# EAGLE design 8 bit (EAGLE 9.6.2)
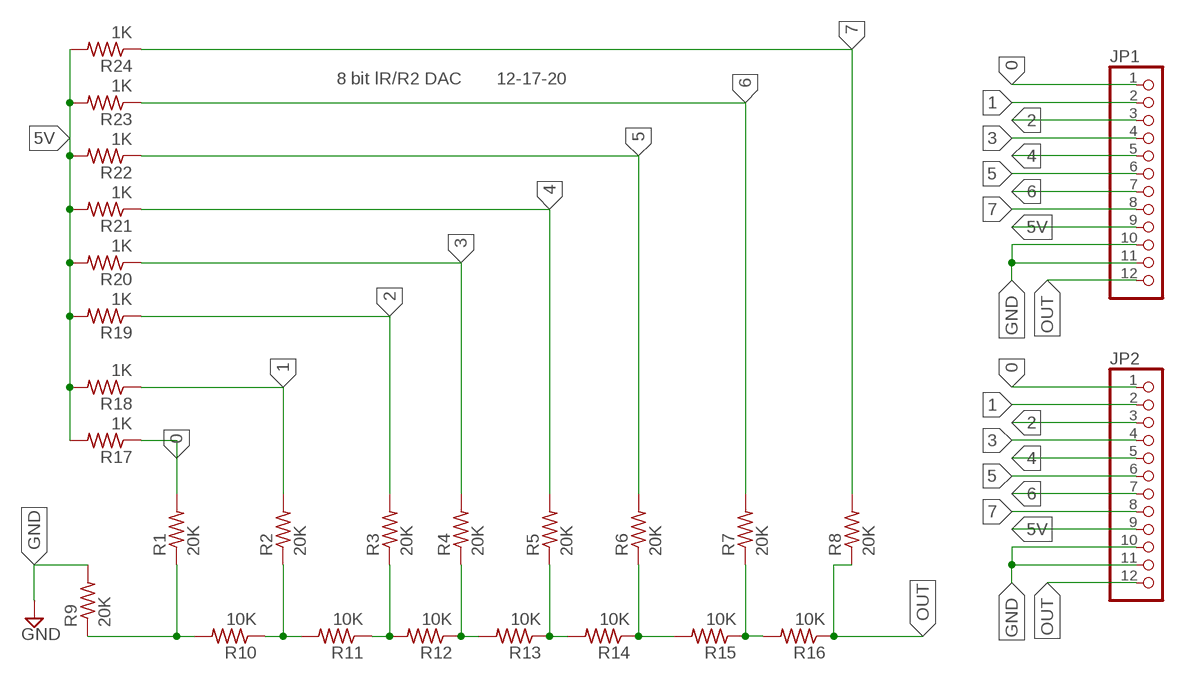
[diagram p0: schematic, sheet 1]

## Parts
JP1  PINHD-1X12  [1X12]
JP2  PINHD-1X12  [1X12]
R1  20K  R-US_0204/7  [0204/7]
R2  20K  R-US_0204/7  [0204/7]
R3  20K  R-US_0204/7  [0204/7]
R4  20K  R-US_0204/7  [0204/7]
R5  20K  R-US_0204/7  [0204/7]
R6  20K  R-US_0204/7  [0204/7]
R7  20K  R-US_0204/7  [0204/7]
R8  20K  R-US_0204/7  [0204/7]
R9  20K  R-US_0204/7  [0204/7]
R10  10K  R-US_0204/7  [0204/7]
R11  10K  R-US_0204/7  [0204/7]
R12  10K  R-US_0204/7  [0204/7]
R13  10K  R-US_0204/7  [0204/7]
R14  10K  R-US_0204/7  [0204/7]
R15  10K  R-US_0204/7  [0204/7]
R16  10K  R-US_0204/7  [0204/7]
R17  1K  R-US_0204/7  [0204/7]
R18  1K  R-US_0204/7  [0204/7]
R19  1K  R-US_0204/7  [0204/7]
R20  1K  R-US_0204/7  [0204/7]
R21  1K  R-US_0204/7  [0204/7]
R22  1K  R-US_0204/7  [0204/7]
R23  1K  R-US_0204/7  [0204/7]
R24  1K  R-US_0204/7  [0204/7]

## Nets
0: JP1.1 JP2.1 R1.2 R17.1
1: JP1.2 JP2.2 R2.2 R18.1
2: JP1.3 JP2.3 R3.2 R19.1
3: JP1.4 JP2.4 R4.2 R20.1
4: JP1.5 JP2.5 R5.2 R21.1
5: JP1.6 JP2.6 R6.2 R22.1
5V: JP1.9 JP2.9 R17.2 R18.2 R19.2 R20.2 R21.2 R22.2 R23.2 R24.2
6: JP1.7 JP2.7 R7.2 R23.1
7: JP1.8 JP2.8 R8.2 R24.1
GND: JP1.10 JP1.11 JP2.10 JP2.11 R9.2
N$1: R1.1 R9.1 R10.2
N$2: R2.1 R10.1 R11.2
N$3: R3.1 R11.1 R12.2
N$4: R4.1 R12.1 R13.2
N$5: R5.1 R13.1 R14.2
N$6: R6.1 R14.1 R15.2
N$7: R7.1 R15.1 R16.2
OUT: JP1.12 JP2.12 R8.1 R16.1

## Notes on the sheet
- 8 bit lR/R2 DAC | 12-17-20

## Library data of the parts
JP1 JP2 = adafruit:PINHD-1X12: PIN HEADER
R1-R24 = rcl:R-US_: RESISTOR, American symbol

## Board
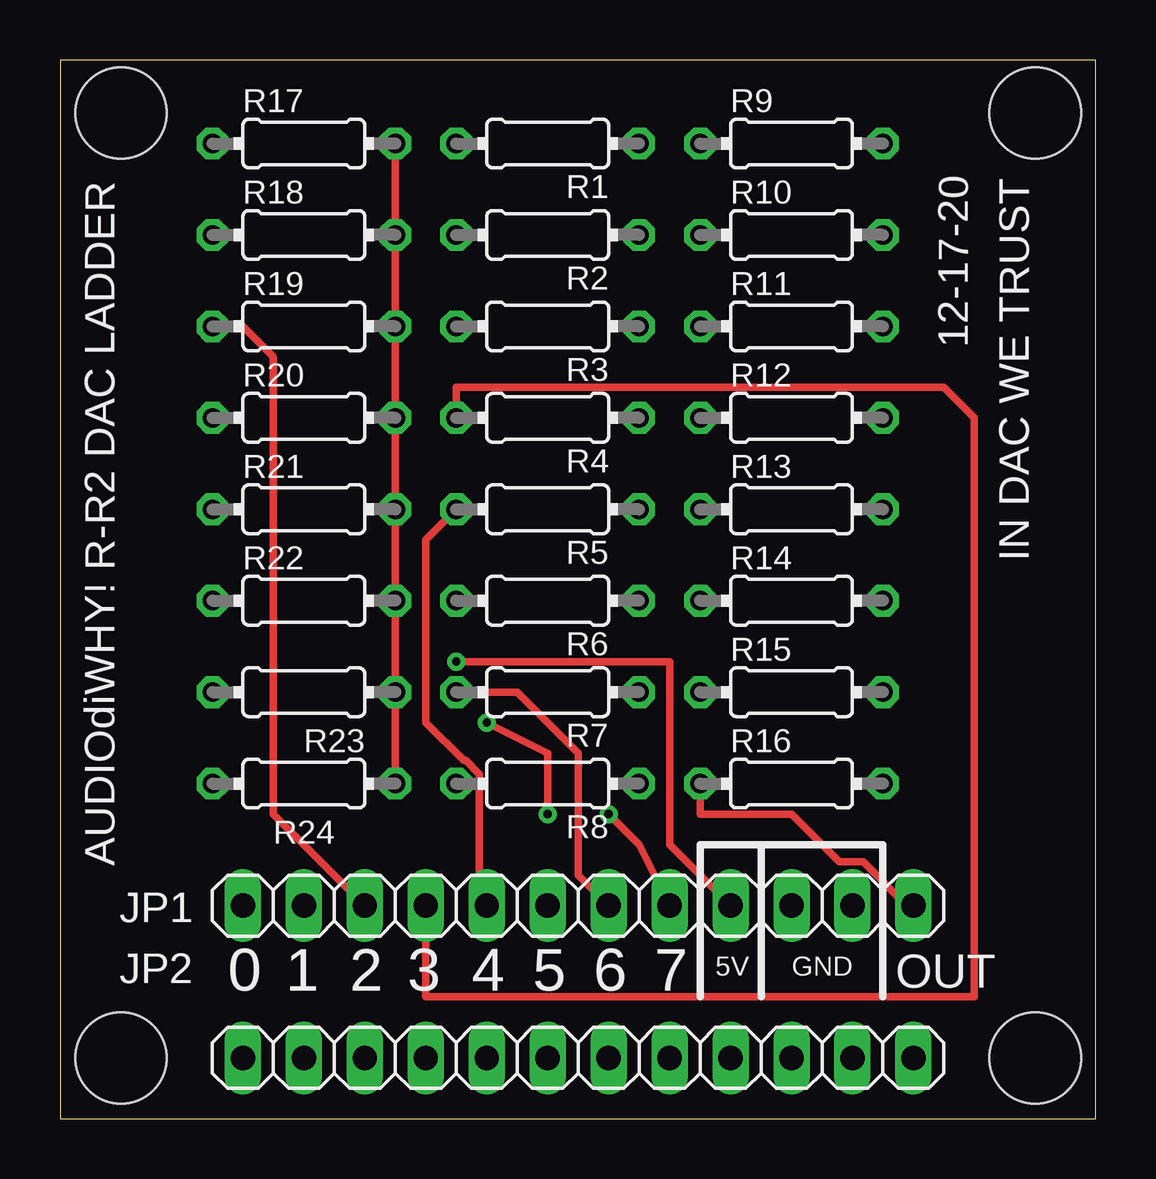
[diagram p1: board, top side]
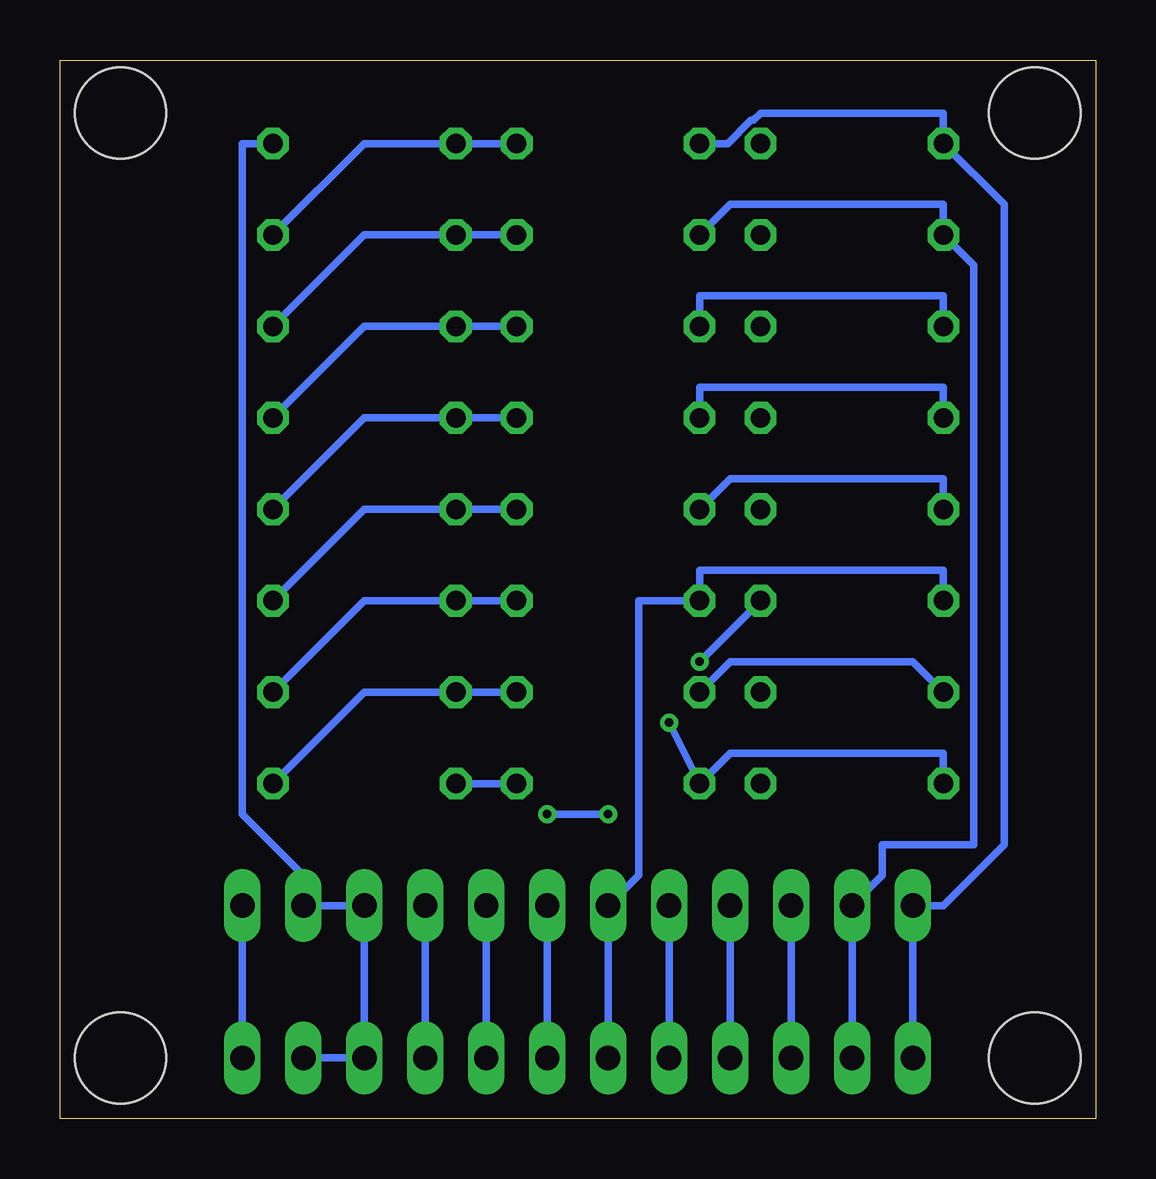
[diagram p2: board, bottom side, seen from below]

Size 43.16 x 44.12 mm. Coordinates in mm from the lower left corner, seen from the top.
Outline: 0,0 43.16,0 43.16,44.12 0,44.12 0,0
Copper layers (1*16): Top 0.035mm / dielectric 1.5mm / Bottom 0.035mm
Design rules "default": minimum track width 6mil, minimum drill 0.35mm, track to track 6mil, track to pad 6mil, pad to pad 6mil, via to via 6mil, smd to smd 6mil, copper to edge 40mil, drill to drill 6mil, minimum pad ring 10mil, minimum via ring 8mil, stop-mask expansion 4mil, vias tented up to drill 0mil, thermal gap 10mil
Holes 3.81 mm at 2.54,41.91 2.54,2.54 40.64,2.54 40.64,41.91

### Footprints (pad centres in the part's own frame; a part is rotated, then mirrored left to right if it is on the bottom)
1X12 = drill 1.016 long: 1 -13.97,0; 2 -11.43,0; 3 -8.89,0; 4 -6.35,0; 5 -3.81,0; 6 -1.27,0; 7 1.27,0; 8 3.81,0; 9 6.35,0; 10 8.89,0; 11 11.43,0; 12 13.97,0
0204/7 = drill 0.813 octagon: 1 -3.81,0; 2 3.81,0

### Placement (x,y rotation side)
JP1  21.59,8.89 0 top
JP2  21.59,2.54 0 top
R1  20.32,40.64 180 top
R2  20.32,36.83 180 top
R3  20.32,33.02 180 top
R4  20.32,29.21 180 top
R5  20.32,25.4 180 top
R6  20.32,21.59 180 top
R7  20.32,17.78 180 top
R8  20.32,13.97 180 top
R9  30.48,40.64 0 top
R10  30.48,36.83 0 top
R11  30.48,33.02 0 top
R12  30.48,29.21 0 top
R13  30.48,25.4 0 top
R14  30.48,21.59 0 top
R15  30.48,17.78 0 top
R16  30.48,13.97 0 top
R17  10.16,40.64 0 top
R18  10.16,36.83 0 top
R19  10.16,33.02 0 top
R20  10.16,29.21 0 top
R21  10.16,25.4 0 top
R22  10.16,21.59 0 top
R23  10.16,17.78 0 top
R24  10.16,13.97 0 top

### Tracks (layer width: path | path; a pad name or v marks a point on that pad's centre or on a via)
0
  Bottom 0.305: R1.2 15.34,40.64 14.37,41.61 14.28,41.61 13.97,41.91 6.35,41.91 R17.1 3.81,38.1 3.81,11.43 6.35,8.89 JP1.1 JP2.1
1
  Bottom 0.305: R2.2 15.24,38.1 6.35,38.1 R18.1 5.08,35.56 5.08,11.43 8.89,11.43 8.89,10.16 JP1.2 JP2.2
2
  Top 0.305: JP1.3 8.89,12.7 8.89,31.75 7.62,33.02 R19.1
  Bottom 0.305: R3.2 16.51,34.29 6.35,34.29 R19.1 | JP2.3 JP1.3
3
  Top 0.305: R4.2 16.51,30.48 36.83,30.48 38.1,29.21 38.1,5.08 15.24,5.08 JP1.4
  Bottom 0.305: R4.2 16.51,30.48 6.35,30.48 R20.1 | JP1.4 JP2.4
4
  Top 0.305: JP1.5 17.48,9.2 17.48,14.37 16.91,14.93 16.82,14.93 15.24,16.51 15.24,24.13 R5.2
  Bottom 0.305: R5.2 15.24,26.67 6.35,26.67 R21.1 | JP2.5 JP1.5
5
  Bottom 0.305: R22.1 6.35,22.86 16.51,22.86 R6.2 19.05,21.59 19.05,10.16 JP1.6 JP2.6
5V  (via drill 0.35)
  Top 0.305: R24.2 R23.2 R22.2 R21.2 R20.2 R19.2 R18.2 R17.2 | JP1.9 25.4,11.43 25.4,19.05 v16.51,19.05
  Bottom 0.305: v16.51,19.05 R22.2 | JP2.9 JP1.9
6
  Top 0.305: JP1.7 21.59,10.16 21.59,15.24 19.05,17.78 R7.2
  Bottom 0.305: R7.2 15.24,19.05 7.62,19.05 R23.1 | JP2.7 JP1.7
7  (via drill 0.35)
  Top 0.305: JP1.8 24.13,11.43 v22.86,12.7 | v20.32,12.7 20.32,15.24 v17.78,16.51
  Bottom 0.305: R24.1 6.35,15.24 15.24,15.24 R8.2 v17.78,16.51 | v22.86,12.7 v20.32,12.7 | JP2.8 JP1.8
GND
  Bottom 0.305: R9.2 35.56,40.64 35.56,12.7 33.02,10.16 JP1.11 JP1.10 JP2.10 JP2.11
N$1
  Bottom 0.305: R10.2 30.48,40.64 R9.1 R1.1
N$2
  Bottom 0.305: R11.2 30.48,36.83 R10.1 R2.1
N$3
  Bottom 0.305: R12.2 30.48,33.02 R11.1 R3.1
N$4
  Bottom 0.305: R13.2 30.48,29.21 R12.1 R4.1
N$5
  Bottom 0.305: R14.2 30.48,25.4 R13.1 R5.1
N$6
  Bottom 0.305: R15.2 30.48,21.59 R14.1 R6.1
N$7
  Bottom 0.305: R16.2 30.48,17.78 R15.1 R7.1
OUT
  Top 0.305: JP1.12 35.29,8.89 33.46,10.72 32.46,10.72 30.48,12.7 26.67,12.7 R16.1
  Bottom 0.305: R8.1 R16.1 | JP2.12 JP1.12

### Text on the board
tNames: 12-17-20 | R-R2 DAC LADDER | IN DAC WE TRUST | AUDIOdiWHY! | 5V | GND | 0 | 1 | 2 | 3 | 4 | 5 | 6 | 7 | OUT